# EAGLE design tempSensor (EAGLE 6.3)
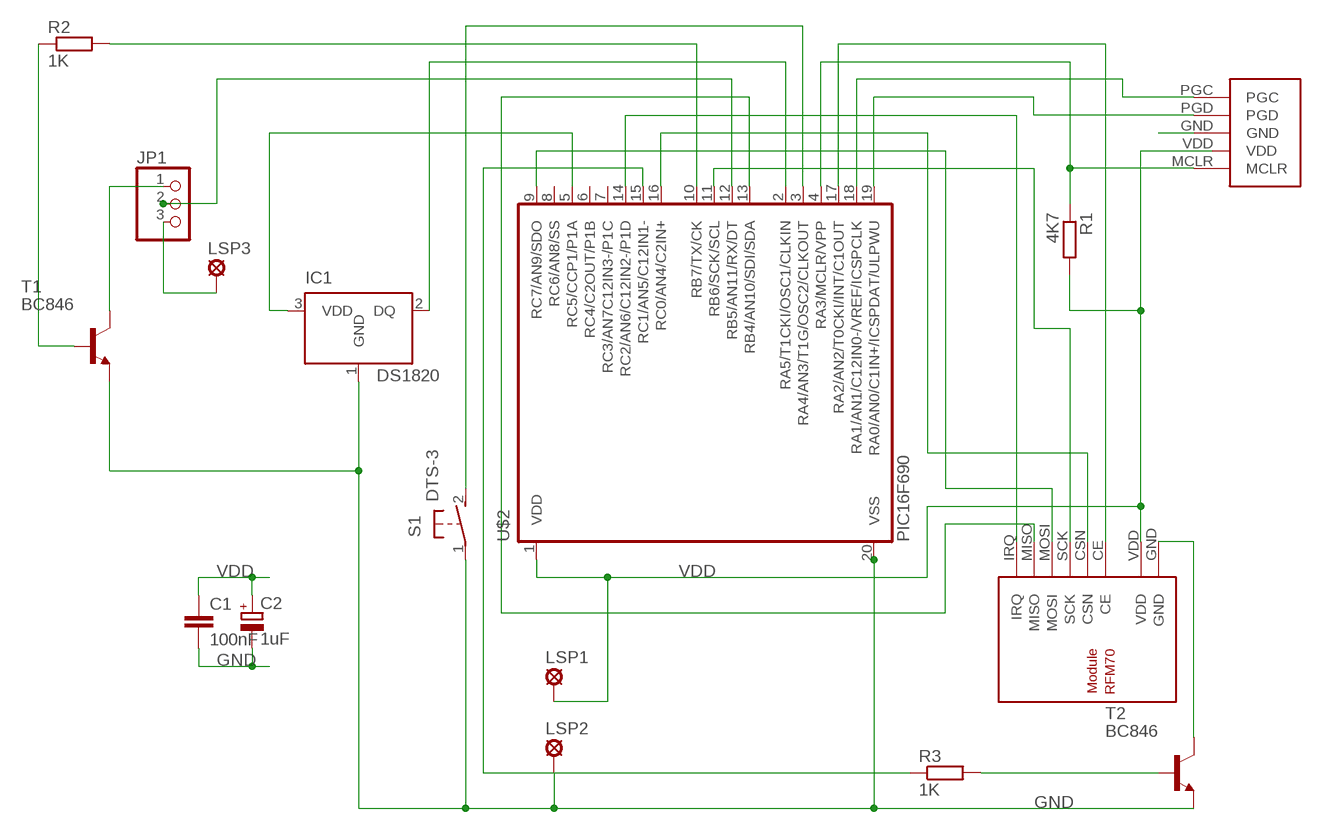
[diagram p0: schematic, sheet 1]

## Parts
C1  100nF  C-EUC2012  [C2012]
C2  1uF  CPOL-EUSMCA  [SMC_A]
IC1  DS1820  [TO-92]
JP1  PINHD-1X3  [1X03]
LSP1  SE14  [SE14]
LSP2  SE14  [SE14]
LSP3  SE14  [SE14]
R1  4K7  R-EU_R1206W  [R1206W]
R2  1K  R-EU_R1206W  [R1206W]
R3  1K  R-EU_R1206W  [R1206W]
S1  DTS-3  [DTS-3]
T1  BC846  [SOT23]
T2  BC846  [SOT23]
U$1  RFM70  [RFM70]
U$2  PIC16F690  [SSOP20]
U$3  PROGRAMMINGHEADERDIP  [PROGHEADER]

## Nets
GND: C1.2 C2.- IC1.1(GND) LSP2.MP S1.1 T1.2(E) T2.2(E) U$2.20(VSS)
N$1: IC1.2(DQ) U$2.2(RA5/T1CKI/OSC1/CLKIN)
N$2: S1.2 U$2.3(RA4/AN3/T1G/OSC2/CLKOUT)
N$3: IC1.3(VDD) U$2.5(RC5/CCP1/P1A)
N$4: JP1.2 U$2.12(RB5/AN11/RX/DT)
N$5: JP1.3 LSP3.MP
N$6: R2.2 U$2.10(RB7/TX/CK)
N$7: R2.1 T1.1(B)
N$8: U$2.19(RA0/AN0/C1IN+/ICSPDAT/ULPWU) U$3.PGD
N$9: JP1.1 T1.3(C)
N$10: U$3.GND
N$11: U$2.18(RA1/AN1/C12IN0-/VREF/ICSPCLK) U$3.PGC
N$12: U$1.MISO U$2.13(RB4/AN10/SDI/SDA)
N$13: T2.3(C) U$1.GND
N$14: R3.2 T2.1(B)
N$15: R3.1 U$2.15(RC1/AN5/C12IN1-)
N$16: U$1.CE U$2.17(RA2/AN2/T0CKI/INT/C1OUT)
N$20: U$1.CSN U$2.16(RC0/AN4/C2IN+)
N$21: U$1.IRQ U$2.14(RC2/AN6/C12IN2-/P1D)
N$22: U$1.SCK U$2.11(RB6/SCK/SCL)
N$23: U$1.MOSI U$2.9(RC7/AN9/SDO)
N$25: R1.1 U$2.4(RA3/MCLR/VPP) U$3.MCLR
VDD: C1.1 C2.+ LSP1.MP R1.2 U$1.VDD U$2.1(VDD)
Unconnected: U$2.6(RC4/C2OUT/P1B) U$2.7(RC3/AN7C12IN3-/P1C) U$2.8(RC6/AN8/SS)

## Power pins joined to a net without a drawn wire
VDD: U$3.VDD

## Library data of the parts
C1 = resistor:C-EU: CAPACITOR, European symbol
C2 = resistor:CPOL-EU: POLARIZED CAPACITOR, European symbol
IC1 = ds1820:DS1820: DS1820 - 1-Wire Digital Thermometer
JP1 = pinhead:PINHD-1X3: PIN HEADER
LSP1-LSP3 = solpad:SE14: SOLDER PAD E1553, drill 1,4mm, distributor Buerklin, 07F820
R1-R3 = resistor:R-EU_: RESISTOR, European symbol
S1 = switch-tact:DTS-3
T1 T2 = transistor:BC846: NPN TRANSISTOR
U$1 = rfm70:RFM70: RFM70 2.4 Ghz Funkmodul Autor: Daniel Weber Website: http://projects.web4clans.com Email: daniel.weber@web4clans.com
U$2 = microchip:PIC16F690*: MICROCONTROLLER PIC16F690 18 I/O One 16-bit timer Two 8-bit timer Two comparators Precision internal oscillator-software selectable 8 MHz - 32 KHz SSP w/ I2C Compatible Address mask option EUSART LIN 2.0 Compatible ECCP+ w/ PWM Steering 12 A/D Channels ULPW Enhanced Low Power Timer 1 Timer 1 Gate Synch Latch 4k Program Flash memory 256 bytes SRAM 256 bytes EEPROM
U$3 = rfm70:PROGRAMMINGHEADER

## Board
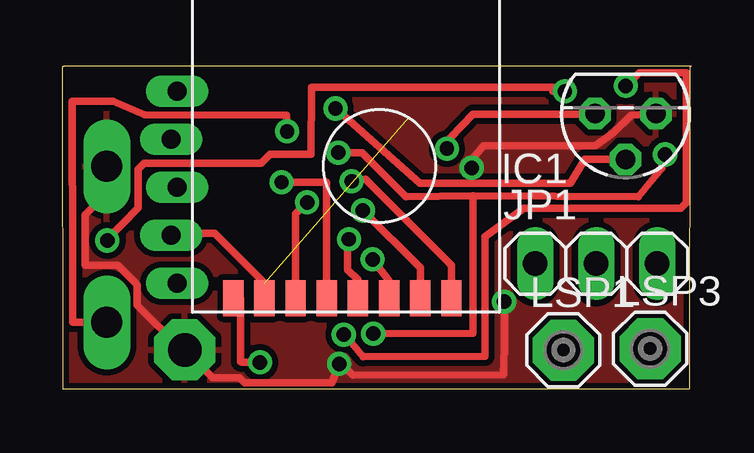
[diagram p1: board, top side]
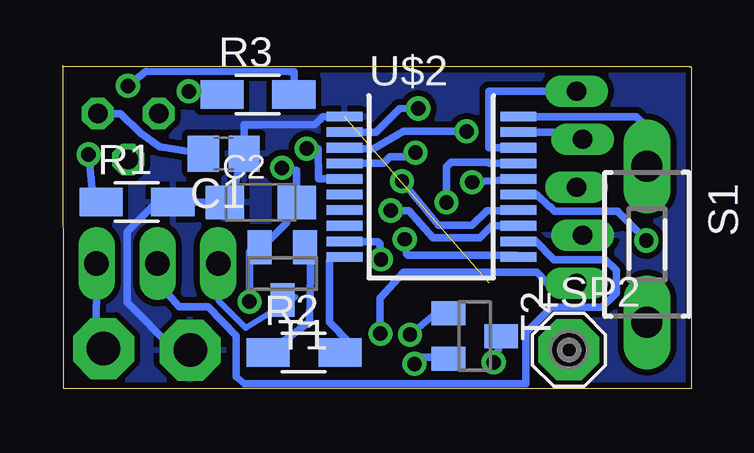
[diagram p2: board, bottom side, seen from below]

Size 26.23 x 13.45 mm. Coordinates in mm from the lower left corner, seen from the top.
Outline: 0.01,0.01 26.17,0 26.19,13.44 26.23,13.44 26.23,13.45 0.06,13.45 0.06,13.43 0,13.43 0.01,0.01
Copper layers (1*16): Top 0.035mm / dielectric 1.5mm / Bottom 0.035mm
Design rules "default *": minimum track width 10mil, minimum drill 24mil, track to track 8mil, track to pad 8mil, pad to pad 8mil, via to via 8mil, smd to smd 8mil, copper to edge 2mil, drill to drill 8mil, minimum pad ring 10mil, minimum via ring 8mil, stop-mask expansion 4mil, vias tented up to drill 0mil, thermal gap 10mil

### Footprints (pad centres in the part's own frame; a part is rotated, then mirrored left to right if it is on the bottom)
C2012 = smd 1.3 x 1.5: 1 -0.85,0; 2 0.85,0
SMC_A = smd 1.6 x 1.4: + -1.5,0; - 1.5,0
TO-92 = drill 0.813 pad 1.27 octagon: 1 -1.27,0; 2 0,1.905; 3 1.27,0
1X03 = drill 1.016 long: 1 -2.54,0; 2 0,0; 3 2.54,0
SE14 = drill 1.397 pad 2.54 octagon: MP 0,0
R1206W = smd 1.8 x 1.2: 1 -1.499,0; 2 1.499,0
DTS-3 = drill 1.3 long: 1 -3.25,0; 2 3.25,0
SOT23 = smd 1 x 1.4: 1 -0.95,-1.1; 2 0.95,-1.1; 3 0,1.1
RFM70 = smd 0.85 x 1.5: CE 2.5,-14.3; CSN 3.8,-14.3; GND -0.1,-14.3; IRQ 9,-14.3; MISO 7.7,-14.3; MOSI 6.4,-14.3; SCK 5.1,-14.3; VDD 1.2,-14.3
SSOP20 = smd 0.4 x 1.5: 1 -2.925,-3.625; 2 -2.275,-3.625; 3 -1.625,-3.625; 4 -0.975,-3.625; 5 -0.325,-3.625; 6 0.325,-3.625; 7 0.975,-3.625; 8 1.625,-3.625; 9 2.275,-3.625; 10 2.925,-3.625; 11 2.925,3.625; 12 2.275,3.625; 13 1.625,3.625; 14 0.975,3.625; 15 0.325,3.625; 16 -0.325,3.625; 17 -0.975,3.625; 18 -1.625,3.625; 19 -2.275,3.625; 20 -2.925,3.625
PROGHEADER = drill 0.8 long: GND 0,0; MCLR -4,0; PGC 4,0; PGD 2,0.25; VDD -2,0.25

### Placement (x,y rotation side)
C1  19.49,9.8 180 bottom
C2  17.96,7.77 0 bottom
IC1  23.48,11.47 180 top
JP1  22.26,5.22 0 top
LSP1  20.89,1.61 0 top
LSP2  5.11,1.63 0 bottom
LSP3  24.51,1.68 0 top
R1  23.11,7.79 0 bottom
R2  16.15,1.51 0 bottom
R3  18.07,12.27 0 bottom
S1  1.85,6.02 270 bottom
T1  17.06,4.8 180 bottom
T2  9.03,2.2 270 bottom
U$1  7.23,18.08 0 top
U$2  10.85,8.42 270 bottom
U$3  4.79,8.39 90 top

### Tracks (layer width: path | path; a pad name or v marks a point on that pad's centre or on a via)
GND  (via drill 0.6)
  Top 0.305: v18.43,3.63 18.44,1.7 18.4,0.58 12.12,0.57 11.59,1.09 v11.54,1.04 11.25,0.25 7.61,0.25 7.4,0.46 6.27,0.46 LSP2.MP 4.99,1.63 3.12,3.49 3.12,4.34 2.31,5.16 0.97,5.16 0.97,7.26 1.85,8.15 S1.1 | v17.07,9.21 17.01,9.46 17.55,10.13 22.21,10.13 22.22,10.12 22.99,10.67 23.73,11.41 IC1.1
  Bottom 0.305: U$2.20 2.29,11.34 1.94,11 1.94,9.36 S1.1 | T1.2 17.9,5.9 17.51,6.29 | v11.54,1.04 11.9,0.94 11.52,1.32 10.16,1.32 T2.2 | 17.51,6.29 16.88,6.92 16.88,7.35 C2.- 16.46,9.12 v17.07,9.21 | 17.51,6.29 17.84,6.29 18.41,5.71 18.41,3.7 v18.43,3.63 | IC1.1 23.79,11.47 22.99,10.67 22.16,10.08 C1.2
  pour Top (isolate 0.254): 0.13,13.3 26.02,13.23 26.11,0.19 0.18,0.15
N$1  (via drill 0.6)
  Top 0.305: IC1.2 21.79,9.56 21.18,8.57 14.91,8.57 v11.39,11.68
  Bottom 0.305: v11.39,11.68 12.17,11.67 13.14,10.69 U$2.2
N$2  (via drill 0.6)
  Top 0.305: S1.2 0.44,2.77 0.44,4.97 0.41,11.98 2.12,11.98 3.44,11.43 9.35,11.4 9.35,10.78 v9.37,10.73
  Bottom 0.305: v9.37,10.73 12,10.73 13.26,10.01 14.43,10.01 U$2.3
N$3  (via drill 0.6)
  Top 0.305: v16.04,10.01 16.17,10.44 17.13,11.44 22.06,11.44 IC1.3
  Bottom 0.305: U$2.5 15.55,8.74 15.56,10.01 v16.04,10.01
N$4
  Bottom 0.305: U$2.12 6.49,6.14 5.79,5.45 5.79,5.44 5.74,5.38 3.58,5.38 3.14,4.94 3.14,3.99 3.73,3.39 5.84,3.39 6.9,2.34 6.9,0.22 18.63,0.22 18.99,0.5 18.99,2.22 20.15,3.42 21.36,3.42 22.26,4.44 JP1.2
N$5
  Bottom 0.305: LSP3.MP 24.82,1.82 JP1.3
N$6
  Bottom 0.305: R2.2 14.29,1.97 15.09,2.77 15.09,5.35 15,5.44 14.53,5.44 U$2.10
N$7
  Bottom 0.305: T1.1 15.86,5.9 15.91,2.79 R2.1
N$8
  Bottom 0.305: U$2.19 4.84,10.69 U$3.PGD
N$9
  Bottom 0.254: T1.3 16.52,3.82 18.58,2.54 19.72,3.7 JP1.1
N$11
  Bottom 0.305: U$3.PGC 8.43,12.39 8.43,10.05 U$2.18
N$12  (via drill 0.6)
  Top 0.305: U$1.MISO 14.93,5.04 v12.53,7.43
  Bottom 0.305: v12.53,7.43 11.77,7.43 10.78,6.29 8.83,6.29 8.75,6.35 8.75,6.36 8.32,6.79 U$2.13
N$13  (via drill 0.6)
  Top 0.305: v8.24,1.1 7.51,1.12 7.43,1.13 7.43,3.77 U$1.GND
  Bottom 0.305: T2.3 8.16,1.22 v8.24,1.1
N$14  (via drill 0.6)
  Top 0.305: v11.73,2.26 11.98,2.03 12.55,1.33 17.63,1.36 17.63,1.45 17.61,6.34 19.24,7.52 25.79,7.52 26.02,7.75 26.02,13.16 26.01,13.17 24.05,13.17 v23.49,12.62
  Bottom 0.305: T2.1 10.53,3.25 v11.73,2.26 | R3.2 16.57,13.21 16.76,13.21 22.73,13.23 v23.49,12.62
N$15  (via drill 0.6)
  Top 0.305: v1.88,6.18 1.88,6.22 3.16,7.54 3.16,9.16 3.42,9.41 8.28,9.41 8.67,9.77 10.38,9.77 10.39,12.57 20.45,12.56 20.45,12.4 v20.95,12.4
  Bottom 0.305: U$2.15 6.43,8.09 5.92,7.58 5.88,7.58 5.7,7.4 3.07,7.4 3.07,7.38 v1.88,6.18 | v20.95,12.4 19.84,12.45 R3.1
N$16  (via drill 0.6)
  Top 0.305: U$1.CE 9.73,7.29 v10.21,7.77
  Bottom 0.305: v10.21,7.77 10.21,9.26 10.03,9.44 8.47,9.44 8.43,9.4 U$2.17
N$20  (via drill 0.6)
  Top 0.305: U$1.CSN 11.03,8.59 11.02,8.61 v9.14,8.61
  Bottom 0.305: v9.14,8.61 U$2.16
N$21  (via drill 0.6)
  Top 0.305: U$1.IRQ 16.23,5.15 12.65,8.72 v12.06,8.65
  Bottom 0.305: v12.06,8.65 12.08,8.7 10.54,6.82 9.14,6.82 8.53,7.43 7.24,7.43 U$2.14
N$22  (via drill 0.6)
  Top 0.305: U$1.SCK 12.33,4.54 11.9,4.97 11.9,6.4 v11.95,6.24
  Bottom 0.305: v11.95,6.24 11.87,5.63 11.81,5.56 7.29,5.56 U$2.11
N$23  (via drill 0.6)
  Top 0.305: U$1.MOSI 13.63,4.5 v12.94,5.4
  Bottom 0.305: v12.94,5.4 12.98,6.04 13.07,6.13 14.46,6.13 U$2.9
N$25  (via drill 0.6)
  Top 0.305: v11.51,9.84 12.5,9.84 14.33,8.01 17.12,8.04 | v25.13,9.77 24.99,9.64 24.99,9.18 24.03,8.01 17.12,8.04 | v12.97,2.3 17.12,2.32 17.12,8.04
  Bottom 0.305: U$2.4 12.84,9.39 12.57,9.66 11.68,9.66 v11.51,9.84 | v25.13,9.77 24.99,8.34 R1.1 | U$3.MCLR 5.99,4.39 6.45,4.85 12,4.85 12.98,3.77 12.98,2.91 v12.97,2.3
VDD  (1 unrouted)
  Top 0.305: U$1.VDD 8.43,4.4 6.35,6.48 4.62,6.48 U$3.VDD
  Bottom 0.305: C1.1 19.19,8.04 C2.+ R1.2 22.29,7.78 23.53,6.54 23.53,3.61 21.58,1.65 20.93,1.65 LSP1.MP | U$2.1 15.36,11.34 15.71,11 18.64,11 C1.1
  Bottom 0.406: C1.1
  pour Bottom (isolate 0.254): 19.85,13.21 26.1,13.27 26.14,0.15 0.15,0.15 0.05,13.31